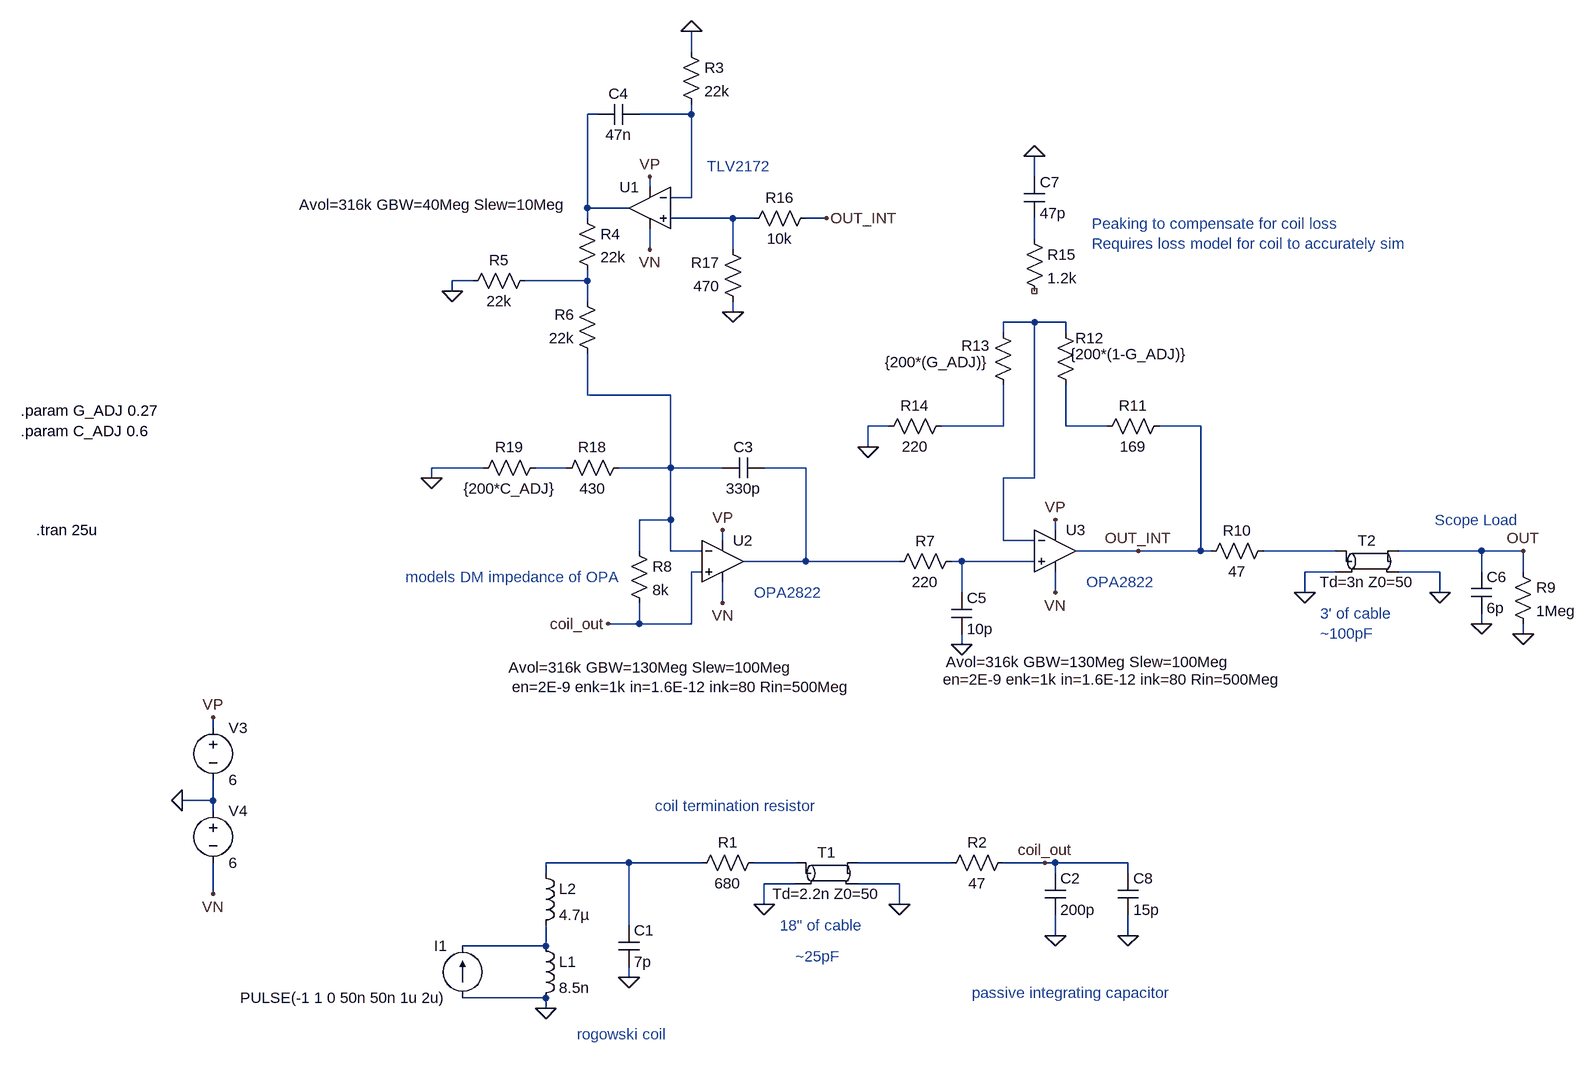
[diagram p0: schematic amp_sim_transient.asc]
amp_sim_transient.asc, the LTspice schematic file:
Version 4
SHEET 1 5128 1112
WIRE 2208 -3712 2208 -3744
WIRE 2064 -3616 2048 -3616
WIRE 2208 -3616 2208 -3632
WIRE 2208 -3616 2128 -3616
WIRE 2736 -3520 2736 -3552
WIRE 2144 -3504 2144 -3520
WIRE 2208 -3488 2208 -3616
WIRE 2208 -3488 2176 -3488
WIRE 2048 -3472 2048 -3616
WIRE 2112 -3472 2048 -3472
WIRE 2048 -3456 2048 -3472
WIRE 2272 -3456 2176 -3456
WIRE 2304 -3456 2272 -3456
WIRE 2416 -3456 2384 -3456
WIRE 2736 -3424 2736 -3456
WIRE 2144 -3408 2144 -3440
WIRE 2272 -3408 2272 -3456
WIRE 1872 -3360 1840 -3360
WIRE 2048 -3360 2048 -3376
WIRE 2048 -3360 1952 -3360
WIRE 1840 -3344 1840 -3360
WIRE 2048 -3328 2048 -3360
WIRE 2272 -3312 2272 -3328
WIRE 2736 -3296 2688 -3296
WIRE 2784 -3296 2736 -3296
WIRE 2688 -3280 2688 -3296
WIRE 2784 -3280 2784 -3296
WIRE 2048 -3184 2048 -3248
WIRE 2176 -3184 2048 -3184
WIRE 2512 -3136 2480 -3136
WIRE 2688 -3136 2688 -3200
WIRE 2688 -3136 2592 -3136
WIRE 2784 -3136 2784 -3200
WIRE 2848 -3136 2784 -3136
WIRE 2992 -3136 2928 -3136
WIRE 2480 -3104 2480 -3136
WIRE 1888 -3072 1808 -3072
WIRE 2016 -3072 1968 -3072
WIRE 2176 -3072 2176 -3184
WIRE 2176 -3072 2096 -3072
WIRE 2256 -3072 2176 -3072
WIRE 2384 -3072 2320 -3072
WIRE 1808 -3056 1808 -3072
WIRE 2736 -3056 2736 -3296
WIRE 2736 -3056 2688 -3056
WIRE 2176 -2992 2176 -3072
WIRE 2176 -2992 2128 -2992
WIRE 2768 -2976 2768 -2992
WIRE 2256 -2960 2256 -2976
WIRE 2688 -2960 2688 -3056
WIRE 2736 -2960 2688 -2960
WIRE 2128 -2944 2128 -2992
WIRE 2176 -2944 2176 -2992
WIRE 2224 -2944 2176 -2944
WIRE 2896 -2944 2800 -2944
WIRE 2992 -2944 2992 -3136
WIRE 2992 -2944 2896 -2944
WIRE 3008 -2944 2992 -2944
WIRE 3200 -2944 3088 -2944
WIRE 3424 -2944 3296 -2944
WIRE 3488 -2944 3424 -2944
WIRE 2384 -2928 2384 -3072
WIRE 2384 -2928 2288 -2928
WIRE 2528 -2928 2384 -2928
WIRE 2624 -2928 2608 -2928
WIRE 2736 -2928 2624 -2928
WIRE 2224 -2912 2208 -2912
WIRE 3200 -2912 3152 -2912
WIRE 3360 -2912 3296 -2912
WIRE 3424 -2912 3424 -2944
WIRE 3488 -2912 3488 -2944
WIRE 2624 -2880 2624 -2928
WIRE 2768 -2880 2768 -2912
WIRE 3152 -2880 3152 -2912
WIRE 3360 -2880 3360 -2912
WIRE 2256 -2864 2256 -2896
WIRE 2128 -2832 2128 -2864
WIRE 2128 -2832 2080 -2832
WIRE 2208 -2832 2208 -2912
WIRE 2208 -2832 2128 -2832
WIRE 3424 -2832 3424 -2848
WIRE 3488 -2816 3488 -2832
WIRE 2624 -2800 2624 -2816
WIRE 1472 -2672 1472 -2688
WIRE 1472 -2560 1472 -2592
WIRE 1472 -2560 1424 -2560
WIRE 1472 -2544 1472 -2560
WIRE 2112 -2464 1984 -2464
WIRE 2224 -2464 2112 -2464
WIRE 2368 -2464 2304 -2464
WIRE 2608 -2464 2464 -2464
WIRE 2752 -2464 2688 -2464
WIRE 2768 -2464 2752 -2464
WIRE 2880 -2464 2768 -2464
WIRE 1984 -2448 1984 -2464
WIRE 2768 -2448 2768 -2464
WIRE 2880 -2448 2880 -2464
WIRE 2368 -2432 2320 -2432
WIRE 2528 -2432 2464 -2432
WIRE 1472 -2416 1472 -2464
WIRE 2320 -2400 2320 -2432
WIRE 2528 -2400 2528 -2432
WIRE 2112 -2368 2112 -2464
WIRE 2768 -2352 2768 -2384
WIRE 2880 -2352 2880 -2384
WIRE 1984 -2336 1984 -2368
WIRE 1984 -2336 1856 -2336
WIRE 2112 -2288 2112 -2304
WIRE 1984 -2256 1856 -2256
WIRE 1984 -2240 1984 -2256
FLAG 1424 -2560 0
FLAG 1472 -2688 VP
FLAG 1472 -2416 VN
FLAG 2112 -2288 0
FLAG 1984 -2240 0
FLAG 2320 -2400 0
FLAG 2528 -2400 0
FLAG 2768 -2352 0
FLAG 2752 -2464 coil_out
FLAG 2256 -2976 VP
FLAG 2256 -2864 VN
FLAG 2144 -3520 VP
FLAG 2144 -3408 VN
FLAG 2208 -3744 0
FLAG 1840 -3344 0
FLAG 2768 -2992 VP
FLAG 2768 -2880 VN
FLAG 2624 -2800 0
FLAG 2080 -2832 coil_out
FLAG 3152 -2880 0
FLAG 3360 -2880 0
FLAG 3424 -2832 0
FLAG 3488 -2816 0
FLAG 2480 -3104 0
FLAG 2736 -3552 0
FLAG 2272 -3312 0
FLAG 2416 -3456 OUT_INT
FLAG 2896 -2944 OUT_INT
FLAG 1808 -3056 0
FLAG 3488 -2944 OUT
FLAG 2880 -2352 0
SYMBOL voltage 1472 -2688 R0
WINDOW 123 0 0 Left 0
WINDOW 39 0 0 Left 0
SYMATTR InstName V3
SYMATTR Value 6
SYMBOL voltage 1472 -2560 R0
WINDOW 123 0 0 Left 0
WINDOW 39 0 0 Left 0
SYMATTR InstName V4
SYMATTR Value 6
SYMBOL ind 1968 -2352 R0
SYMATTR InstName L1
SYMATTR Value 8.5n
SYMATTR SpiceLine Rser=0
SYMBOL ind 1968 -2464 R0
SYMATTR InstName L2
SYMATTR Value 4.7µ
SYMBOL cap 2096 -2368 R0
SYMATTR InstName C1
SYMATTR Value 7p
SYMBOL res 2320 -2480 R90
WINDOW 0 0 56 VBottom 2
WINDOW 3 32 56 VTop 2
SYMATTR InstName R1
SYMATTR Value 680
SYMBOL res 2704 -2480 R90
WINDOW 0 0 56 VBottom 2
WINDOW 3 32 56 VTop 2
SYMATTR InstName R2
SYMATTR Value 47
SYMBOL tline 2416 -2448 R0
SYMATTR InstName T1
SYMATTR Value Td=2.2n Z0=50
SYMBOL cap 2752 -2448 R0
SYMATTR InstName C2
SYMATTR Value 200p
SYMBOL cap 2320 -3088 R90
WINDOW 0 0 32 VBottom 2
WINDOW 3 32 32 VTop 2
SYMATTR InstName C3
SYMATTR Value 330p
SYMBOL res 2192 -3728 R0
SYMATTR InstName R3
SYMATTR Value 22k
SYMBOL cap 2128 -3632 R90
WINDOW 0 0 32 VBottom 2
WINDOW 3 32 32 VTop 2
SYMATTR InstName C4
SYMATTR Value 47n
SYMBOL res 2032 -3472 R0
SYMATTR InstName R4
SYMATTR Value 22k
SYMBOL res 1968 -3376 R90
WINDOW 0 0 56 VBottom 2
WINDOW 3 32 56 VTop 2
SYMATTR InstName R5
SYMATTR Value 22k
SYMBOL res 2064 -3232 R180
WINDOW 0 36 76 Left 2
WINDOW 3 36 40 Left 2
SYMATTR InstName R6
SYMATTR Value 22k
SYMBOL res 2624 -2944 R90
WINDOW 0 0 56 VBottom 2
WINDOW 3 32 56 VTop 2
SYMATTR InstName R7
SYMATTR Value 220
SYMBOL cap 2608 -2880 R0
SYMATTR InstName C5
SYMATTR Value 10p
SYMBOL OpAmps\\UniversalOpamp2 2144 -3472 M0
WINDOW 123 127 -5 Left 2
SYMATTR Value2 Avol=316k GBW=40Meg Slew=10Meg
SYMATTR InstName U1
SYMATTR SpiceLine2 en=1E-9 enk=25 in=0.04E-12 ink=2k Rin=500Meg
SYMBOL res 2112 -2960 R0
SYMATTR InstName R8
SYMATTR Value 8k
SYMBOL OpAmps\\UniversalOpamp2 2256 -2928 R0
WINDOW 123 -329 163 Left 2
WINDOW 40 -324 193 Left 2
SYMATTR Value2 Avol=316k GBW=130Meg Slew=100Meg
SYMATTR SpiceLine2 en=2E-9 enk=1k in=1.6E-12 ink=80 Rin=500Meg
SYMATTR InstName U2
SYMATTR SpiceLine ilimit=80m rail=0 Vos=0 phimargin=45
SYMBOL tline 3248 -2928 R0
SYMATTR InstName T2
SYMATTR Value Td=3n Z0=50
SYMBOL res 3472 -2928 R0
SYMATTR InstName R9
SYMATTR Value 1Meg
SYMBOL cap 3408 -2912 R0
SYMATTR InstName C6
SYMATTR Value 6p
SYMBOL res 3104 -2960 R90
WINDOW 0 0 56 VBottom 2
WINDOW 3 32 56 VTop 2
SYMATTR InstName R10
SYMATTR Value 47
SYMBOL OpAmps\\UniversalOpamp2 2768 -2944 R0
WINDOW 123 -168 171 Left 2
WINDOW 40 -173 198 Left 2
SYMATTR Value2 Avol=316k GBW=130Meg Slew=100Meg
SYMATTR SpiceLine2 en=2E-9 enk=1k in=1.6E-12 ink=80 Rin=500Meg
SYMATTR InstName U3
SYMATTR SpiceLine ilimit=80m rail=0 Vos=0 phimargin=45
SYMBOL current 1856 -2256 R180
WINDOW 0 24 80 Left 2
WINDOW 3 24 0 Left 2
WINDOW 39 0 0 Left 0
SYMATTR InstName I1
SYMATTR Value PULSE(-1 1 0 50n 50n 1u 2u)
SYMATTR Value2 AC 1
SYMBOL res 2944 -3152 R90
WINDOW 0 0 56 VBottom 2
WINDOW 3 32 56 VTop 2
SYMATTR InstName R11
SYMATTR Value 169
SYMBOL res 2800 -3184 R180
WINDOW 0 -43 88 Left 2
WINDOW 3 -173 63 Left 2
SYMATTR InstName R12
SYMATTR Value {200*(1-G_ADJ)}
SYMBOL res 2704 -3184 R180
WINDOW 0 36 76 Left 2
WINDOW 3 38 51 Left 2
SYMATTR InstName R13
SYMATTR Value {200*(G_ADJ)}
SYMBOL res 2608 -3152 R90
WINDOW 0 0 56 VBottom 2
WINDOW 3 32 56 VTop 2
SYMATTR InstName R14
SYMATTR Value 220
SYMBOL res 2720 -3440 R0
SYMATTR InstName R15
SYMATTR Value 1.2k
SYMBOL cap 2720 -3520 R0
SYMATTR InstName C7
SYMATTR Value 47p
SYMBOL res 2400 -3472 R90
WINDOW 0 0 56 VBottom 2
WINDOW 3 32 56 VTop 2
SYMATTR InstName R16
SYMATTR Value 10k
SYMBOL res 2288 -3312 R180
WINDOW 0 36 76 Left 2
WINDOW 3 36 40 Left 2
SYMATTR InstName R17
SYMATTR Value 470
SYMBOL res 2112 -3088 R90
WINDOW 0 0 56 VBottom 2
WINDOW 3 32 56 VTop 2
SYMATTR InstName R18
SYMATTR Value 430
SYMBOL res 1984 -3088 R90
WINDOW 0 0 56 VBottom 2
WINDOW 3 32 56 VTop 2
SYMATTR InstName R19
SYMATTR Value {200*C_ADJ}
SYMBOL cap 2864 -2448 R0
SYMATTR InstName C8
SYMATTR Value 15p
TEXT 1200 -2976 Left 2 !.tran 25u
TEXT 2344 -2368 Left 2 ;18" of cable
TEXT 2152 -2552 Left 2 ;coil termination resistor
TEXT 2640 -2264 Left 2 ;passive integrating capacitor
TEXT 2368 -2320 Left 2 ;~25pF
TEXT 1768 -2904 Left 2 ;models DM impedance of OPA
TEXT 3176 -2848 Left 2 ;3' of cable\n~100pF
TEXT 2824 -3448 Left 2 ;Peaking to compensate for coil loss\nRequires loss model for coil to accurately sim
TEXT 3352 -2992 Left 2 ;Scope Load
TEXT 1176 -3160 Left 2 !.param G_ADJ 0.27\n.param C_ADJ 0.6
TEXT 2304 -2880 Left 2 ;OPA2822
TEXT 2816 -2896 Left 2 ;OPA2822
TEXT 2232 -3536 Left 2 ;TLV2172
TEXT 2032 -2200 Left 2 ;rogowski coil

The netlist it stands for:
* amp_sim_transient.asc
V3 VP 0 6
V4 0 VN 6
L1 N017 0 8.5n Rser=0
L2 N014 N017 4.7µ
C1 N014 0 7p
R1 N015 N014 680
R2 coil_out N016 47
T1 N015 0 N016 0 Td=2.2n Z0=50
C2 coil_out 0 200p
C3 N011 N007 330p
R3 0 N002 22k
C4 N002 N001 47n
R4 N001 N005 22k
R5 N005 0 22k
R6 N007 N005 22k
R7 N013 N011 220
C5 N013 0 10p
XU1 N003 N002 VP VN N001 level.2 Avol=316k GBW=40Meg Slew=10Meg ilimit=25m rail=0 Vos=0 phimargin=45 en=1E-9 enk=25 in=0.04E-12 ink=2k Rin=500Meg  ; pins IN+ IN- V+ V- OUT
R8 N007 coil_out 8k
XU2 coil_out N007 VP VN N011 level.2 Avol=316k GBW=130Meg Slew=100Meg ilimit=80m rail=0 Vos=0 phimargin=45 en=2E-9 enk=1k in=1.6E-12 ink=80 Rin=500Meg  ; pins IN+ IN- V+ V- OUT
T2 N012 0 OUT 0 Td=3n Z0=50
R9 OUT 0 1Meg
C6 OUT 0 6p
R10 N012 OUT_INT 47
XU3 N013 N006 VP VN OUT_INT level.2 Avol=316k GBW=130Meg Slew=100Meg ilimit=80m rail=0 Vos=0 phimargin=45 en=2E-9 enk=1k in=1.6E-12 ink=80 Rin=500Meg  ; pins IN+ IN- V+ V- OUT
I1 0 N017 PULSE(-1 1 0 50n 50n 1u 2u) AC 1
R11 OUT_INT N009 169
R12 N009 N006 {200*(1-G_ADJ)}
R13 N008 N006 {200*(G_ADJ)}
R14 N008 0 220
R15 N004 NC_01 1.2k
C7 0 N004 47p
R16 OUT_INT N003 10k
R17 0 N003 470
R18 N007 N010 430
R19 N010 0 {200*C_ADJ}
C8 coil_out 0 15p
.tran 25u
* 18" of cable
* coil termination resistor
* passive integrating capacitor
* ~25pF
* models DM impedance of OPA
* 3' of cable
* ~100pF
* Peaking to compensate for coil loss
* Requires loss model for coil to accurately sim
* Scope Load
.param G_ADJ 0.27
.param C_ADJ 0.6
* OPA2822
* OPA2822
* TLV2172
* rogowski coil
.lib UniversalOpamps2.sub
.backanno
.end